# Altium schematic sheet ATWork2022.SchDoc
size 558 x 431 mm; SheetNumber: 1; SheetTotal: 1; SPICEModelCacheMCJPWGMP: <root> / <DocumentId>MCJPWGMP</DocumentId> / <CacheFrame Number="0"> / <Model Name="adc8" Kind="MDL"> / <Text>* 8-Bit generic A/D converter / * INPUTS  VCC, GND, VIN, VRP, VRM, SC, OE; / * OUTPUTS VCC_LD, SC_LD, OE_LD, OC, D0, D1, D2, D3, D4, D5, D6, D7; / .MODEL ADC8 xsimcode(file="{MODEL_PATH}ADC8.scb" func=ADC8 {mntymx})</Text> / </Model> / </CacheFrame> / </root>
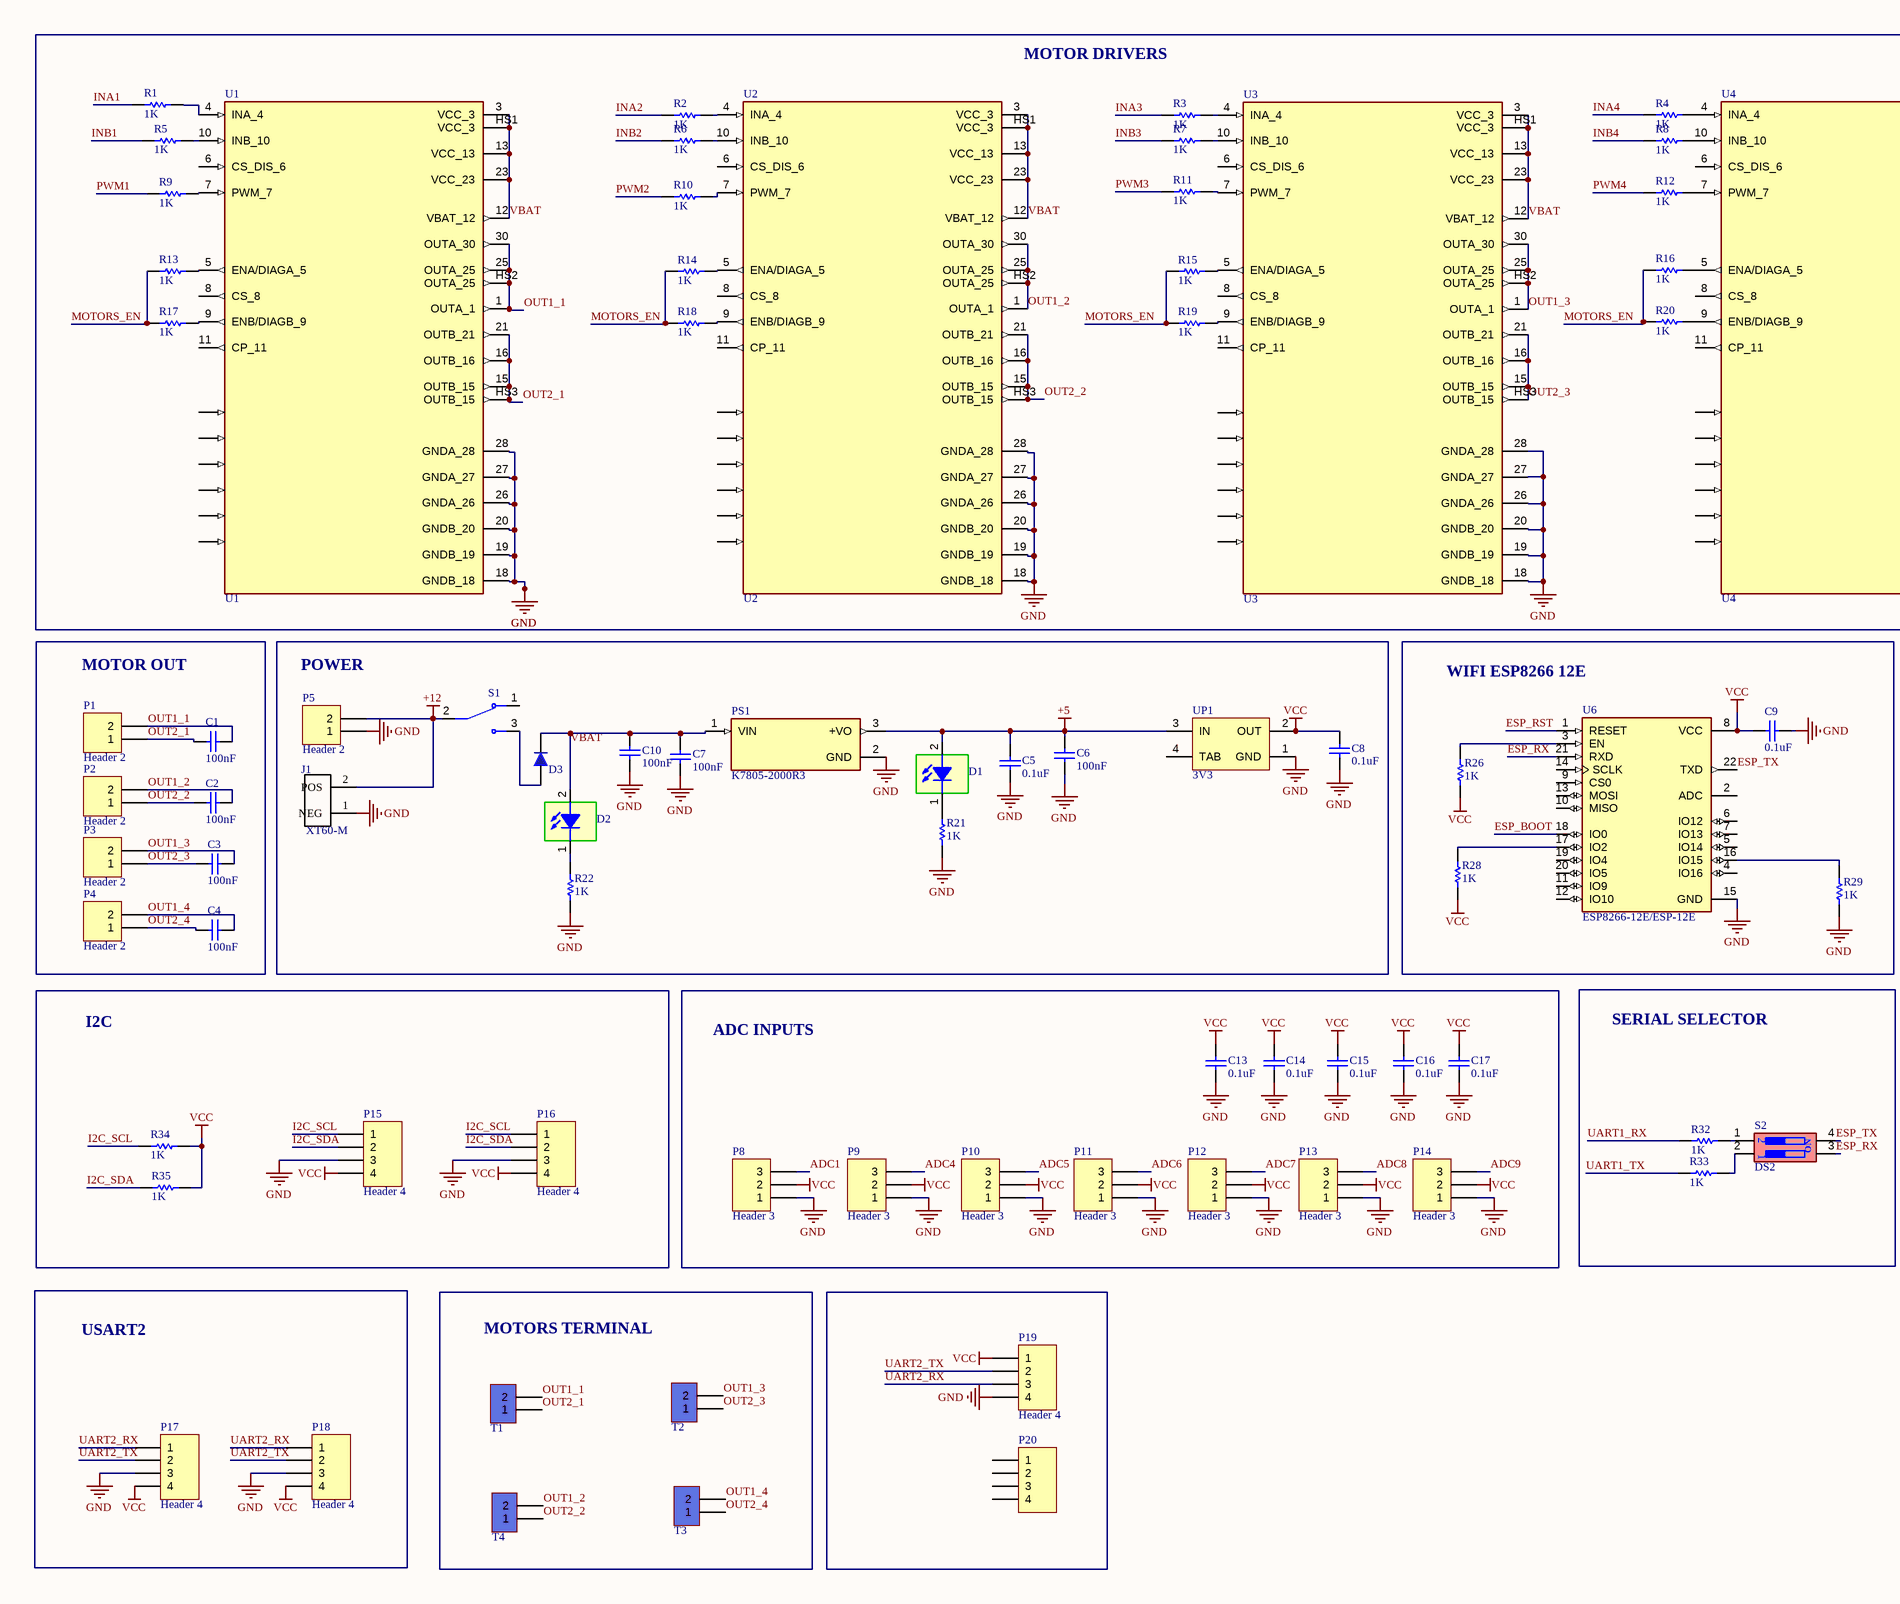
[diagram p0: ATWork2022.SchDoc, left]
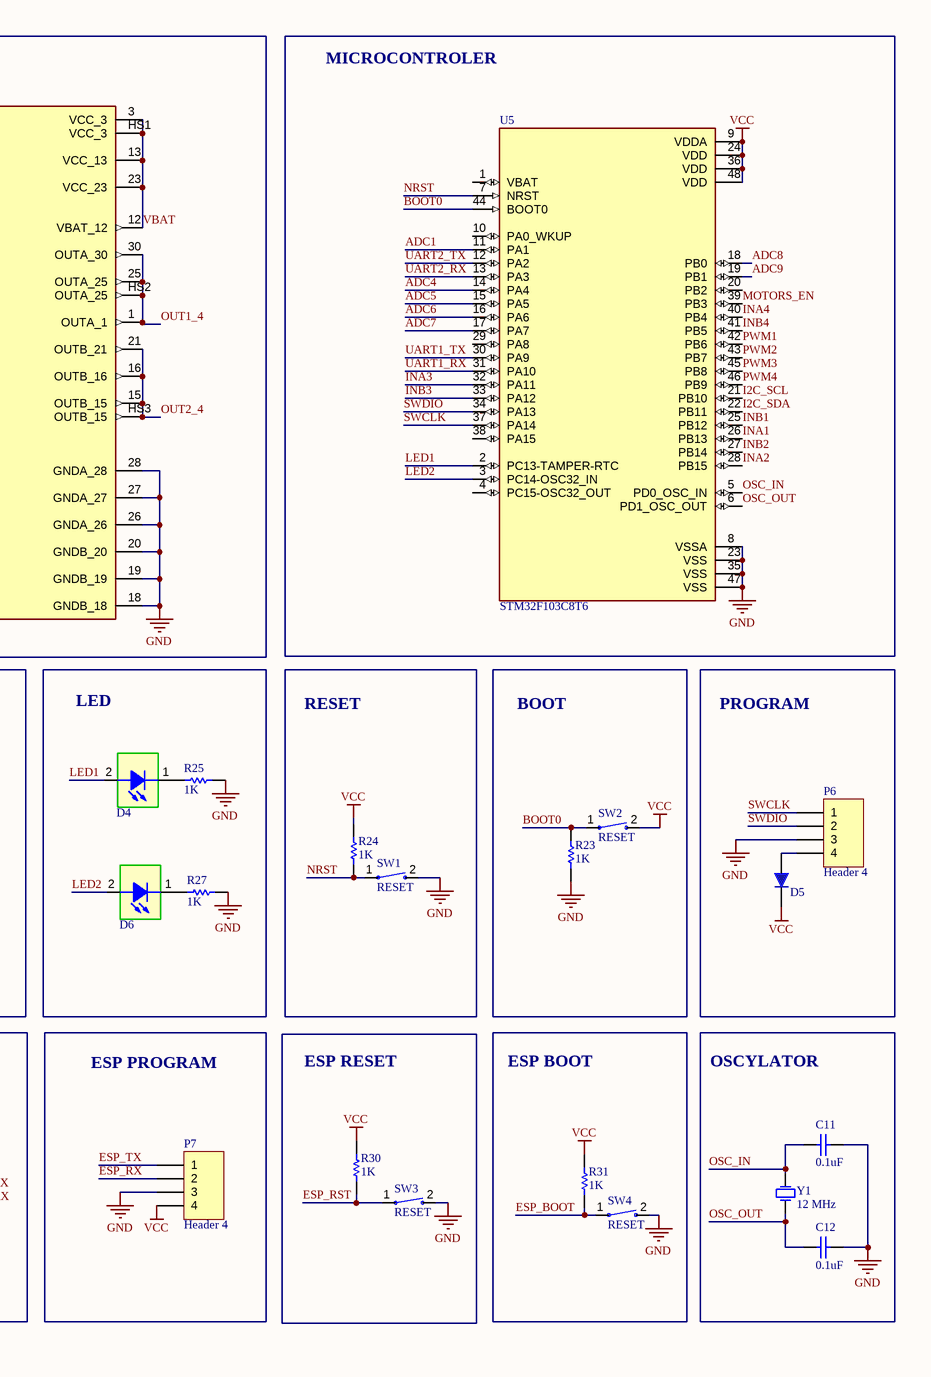
[diagram p1: ATWork2022.SchDoc, right]

## Parts
C1  100nF  [CAPC4817X12N]
C2  100nF  [CAPC4817X12N]
C3  100nF  [CAPC4817X12N]
C4  100nF  [CAPC4817X12N]
C5  0.1uF  [CAPC4817X12N]
C6  100nF  [Cap SMD 100UF 35~50v]
C7  100nF  [Cap SMD 100UF 35~50v]
C8  0.1uF  [CAPC4817X12N]
C9  0.1uF  [CAPC4817X12N]
C10  100nF  [Cap SMD 100UF 35~50v]
C11  0.1uF  [CAPC4817X12N]
C12  0.1uF  [CAPC4817X12N]
C13  0.1uF  [CAPC4817X12N]
C14  0.1uF  [CAPC4817X12N]
C15  0.1uF  [CAPC4817X12N]
C16  0.1uF  [CAPC4817X12N]
C17  0.1uF  [CAPC4817X12N]
D1  SMD 1206 LED  [LED 1206]  (value not drawn)
D2  SMD 1206 LED  [LED 1206]  (value not drawn)
D3  1n4007  [DIOM4629X24N]  (value not drawn)
D4  SMD 1206 LED  [LED 1206]  (value not drawn)
D5  1n4007  [DIOM4629X24N]  (value not drawn)
D6  SMD 1206 LED  [LED 1206]  (value not drawn)
J1  XT60-M  [*AMASS_XT60-M]
P1  Header 2  [HDR1X2]
P2  Header 2  [HDR1X2]
P3  Header 2  [HDR1X2]
P4  Header 2  [HDR1X2]
P5  Header 2  [HDR1X2]
P6  Header 4  [HDR1X4]
P7  Header 4  [HDR1X4]
P8  Header 3  [HDR1X3]
P9  Header 3  [HDR1X3]
P10  Header 3  [HDR1X3]
P11  Header 3  [HDR1X3]
P12  Header 3  [HDR1X3]
P13  Header 3  [HDR1X3]
P14  Header 3  [HDR1X3]
P15  Header 4  [HDR1X4]
P16  Header 4  [HDR1X4]
P17  Header 4  [HDR1X4]
P18  Header 4  [HDR1X4]
P19  Header 4  [HDR1X4]
P20  Header 4  [My_1X04]  (value not drawn)
PS1  K7805-2000R3  [CONV_K7805-2000R3]
R1  1K  [RESC3413X04N]
R2  1K  [RESC3413X04N]
R3  1K  [RESC3413X04N]
R4  1K  [RESC3413X04N]
R5  1K  [RESC3413X04N]
R6  1K  [RESC3413X04N]
R7  1K  [RESC3413X04N]
R8  1K  [RESC3413X04N]
R9  1K  [RESC3413X04N]
R10  1K  [RESC3413X04N]
R11  1K  [RESC3413X04N]
R12  1K  [RESC3413X04N]
R13  1K  [RESC3413X04N]
R14  1K  [RESC3413X04N]
R15  1K  [RESC3413X04N]
R16  1K  [RESC3413X04N]
R17  1K  [RESC3413X04N]
R18  1K  [RESC3413X04N]
R19  1K  [RESC3413X04N]
R20  1K  [RESC3413X04N]
R21  1K  [RESC3413X04N]
R22  1K  [RESC3413X04N]
R23  1K  [RESC3413X04N]
R24  1K  [RESC3413X04N]
R25  1K  [RESC3413X04N]
R26  1K  [RESC3413X04N]
R27  1K  [RESC3413X04N]
R28  1K  [RESC3413X04N]
R29  1K  [RESC3413X04N]
R30  1K  [RESC3413X04N]
R31  1K  [RESC3413X04N]
R32  1K  [RESC3413X04N]
R33  1K  [RESC3413X04N]
R34  1K  [RESC3413X04N]
R35  1K  [RESC3413X04N]
S1  (no value)  [SW_100SP1T1B4M2QE]
S2  DS2  [DIP Switch x2]
SW1  RESET  [SW_147873-1]
SW2  RESET  [SW_147873-1]
SW3  RESET  [SW_147873-1]
SW4  RESET  [SW_147873-1]
T1  KF301_Terminal  [KF301 2PIN]  (value not drawn)
T2  KF301_Terminal  [KF301 2PIN]  (value not drawn)
T3  KF301_Terminal  [KF301 2PIN]  (value not drawn)
T4  KF301_Terminal  [KF301 2PIN]  (value not drawn)
U1  U1  [IC_MULTIPOWERSO-30TR]
U2  U2  [IC_MULTIPOWERSO-30TR]
U3  U3  [IC_MULTIPOWERSO-30TR]
U4  U4  [IC_MULTIPOWERSO-30TR]
U5  STM32F103C8T6  [QFP50P900X900X160-48N]
U6  ESP8266-12E/ESP-12E  [XCVR_ESP8266-12E/ESP-12E]
UP1  3V3  [SOT223]
Y1  12 MHz  [Crystal SMD]

## Nets
+5: C5.2 C6.1 D1.2 PS1.3(+VO) UP1.3(IN)
+12: J1.2(POS) P5.2 S1.2
GND: C5.1 C6.2 C7.2 C8.1 C9.1 C10.2 C11.2 C12.2 C13.2 C14.2 C15.2 C16.2 C17.2 J1.1(NEG) P5.1 P6.3 P7.3 P8.1 P9.1 P10.1 P11.1 P12.1 P13.1 P14.1 P15.3 P16.3 P17.3 P18.3 P19.4 PS1.2(GND) R21.1 R22.1 R23.1 R25.1 R27.1 R29.1 SW1.2 SW3.2 SW4.2 U1.18(GNDB_18) U1.19(GNDB_19) U1.20(GNDB_20) U1.26(GNDA_26) U1.27(GNDA_27) U1.28(GNDA_28) U2.18(GNDB_18) U2.19(GNDB_19) U2.20(GNDB_20) U2.26(GNDA_26) U2.27(GNDA_27) U2.28(GNDA_28) U3.18(GNDB_18) U3.19(GNDB_19) U3.20(GNDB_20) U3.26(GNDA_26) U3.27(GNDA_27) U3.28(GNDA_28) U4.18(GNDB_18) U4.19(GNDB_19) U4.20(GNDB_20) U4.26(GNDA_26) U4.27(GNDA_27) U4.28(GNDA_28) U5.8(VSSA) U5.23(VSS) U5.35(VSS) U5.47(VSS) U6.15(GND) UP1.1(GND)
VCC: C8.2 C9.2 C13.1 C14.1 C15.1 C16.1 C17.1 D5.2 P7.4 P8.2 P9.2 P10.2 P11.2 P12.2 P13.2 P14.2 P15.4 P16.4 P17.4 P18.4 P19.1 R24.1 R26.2 R28.2 R30.2 R31.2 R34.2 R35.2 SW2.2 U5.9(VDDA) U5.24(VDD) U5.36(VDD) U5.48(VDD) U6.8(VCC) UP1.2(OUT)
ADC1: P8.3 U5.11(PA1)
ADC4: P9.3 U5.14(PA4)
ADC5: P10.3 U5.15(PA5)
ADC6: P11.3 U5.16(PA6)
ADC7: P12.3 U5.17(PA7)
ADC8: P13.3 U5.18(PB0)
ADC9: P14.3 U5.19(PB1)
BOOT0: R23.2 SW2.1 U5.44(BOOT0)
ESP_BOOT: R31.1 SW4.1 U6.18(IO0)
ESP_RST: R30.1 SW3.1 U6.1(RESET)
ESP_RX: P7.2 S2.3 U6.21(RXD)
ESP_TX: P7.1 S2.4 U6.22(TXD)
I2C_SCL: P15.1 P16.1 R34.1 U5.21(PB10)
I2C_SDA: P15.2 P16.2 R35.1 U5.22(PB11)
INA1: R1.1 U5.26(PB13)
INA2: R2.1 U5.28(PB15)
INA3: R3.1 U5.32(PA11)
INA4: R4.1 U5.40(PB4)
INB1: R5.1 U5.25(PB12)
INB2: R6.1 U5.27(PB14)
INB3: R7.1 U5.33(PA12)
INB4: R8.1 U5.41(PB5)
LED1: D4.2 U5.2(PC13-TAMPER-RTC)
LED2: D6.2 U5.3(PC14-OSC32_IN)
MOTORS_EN: R13.1 R14.1 R15.1 R16.1 R17.1 R18.1 R19.1 R20.1 U5.39(PB3)
NRST: R24.2 SW1.1 U5.7(NRST)
OSC_IN: C11.1 U5.5(PD0_OSC_IN) Y1.2(OSC2)
OSC_OUT: C12.1 U5.6(PD1_OSC_OUT) Y1.1(OSC1)
OUT1_1: C1.1 P1.2 T1.2 U1.1(OUTA_1) U1.25(OUTA_25) U1.30(OUTA_30) U1.HS2(OUTA_25)
OUT1_2: C2.1 P2.2 T4.2 U2.1(OUTA_1) U2.25(OUTA_25) U2.30(OUTA_30) U2.HS2(OUTA_25)
OUT1_3: C3.1 P3.2 T2.2 U3.1(OUTA_1) U3.25(OUTA_25) U3.30(OUTA_30) U3.HS2(OUTA_25)
OUT1_4: C4.1 P4.2 T3.2 U4.1(OUTA_1) U4.25(OUTA_25) U4.30(OUTA_30) U4.HS2(OUTA_25)
OUT2_1: C1.2 P1.1 T1.1 U1.15(OUTB_15) U1.16(OUTB_16) U1.21(OUTB_21) U1.HS3(OUTB_15)
OUT2_2: C2.2 P2.1 T4.1 U2.15(OUTB_15) U2.16(OUTB_16) U2.21(OUTB_21) U2.HS3(OUTB_15)
OUT2_3: C3.2 P3.1 T2.1 U3.15(OUTB_15) U3.16(OUTB_16) U3.21(OUTB_21) U3.HS3(OUTB_15)
OUT2_4: C4.2 P4.1 T3.1 U4.15(OUTB_15) U4.16(OUTB_16) U4.21(OUTB_21) U4.HS3(OUTB_15)
PWM1: R9.1 U5.42(PB6)
PWM2: R10.1 U5.43(PB7)
PWM3: R11.1 U5.45(PB8)
PWM4: R12.1 U5.46(PB9)
SWCLK: P6.1 U5.37(PA14)
SWDIO: P6.2 U5.34(PA13)
UART1_RX: R32.1 U5.31(PA10)
UART1_TX: R33.2 U5.30(PA9)
UART2_RX: P17.1 P18.1 P19.3 U5.13(PA3)
UART2_TX: P17.2 P18.2 P19.2 U5.12(PA2)
VBAT: C7.1 C10.1 D2.2 D3.2 PS1.1(VIN) U1.3(VCC_3) U1.12(VBAT_12) U1.13(VCC_13) U1.23(VCC_23) U1.HS1(VCC_3) U2.3(VCC_3) U2.12(VBAT_12) U2.13(VCC_13) U2.23(VCC_23) U2.HS1(VCC_3) U3.3(VCC_3) U3.12(VBAT_12) U3.13(VCC_13) U3.23(VCC_23) U3.HS1(VCC_3) U4.3(VCC_3) U4.12(VBAT_12) U4.13(VCC_13) U4.23(VCC_23) U4.HS1(VCC_3)
NetD1_1: D1.1 R21.2
NetD2_1: D2.1 R22.2
NetD3_1: D3.1 S1.3
NetD4_1: D4.1 R25.2
NetD5_1: D5.1 P6.4
NetD6_1: D6.1 R27.2
NetR1_2: R1.2 U1.4(INA_4)
NetR2_2: R2.2 U2.4(INA_4)
NetR3_2: R3.2 U3.4(INA_4)
NetR4_2: R4.2 U4.4(INA_4)
NetR5_2: R5.2 U1.10(INB_10)
NetR6_2: R6.2 U2.10(INB_10)
NetR7_2: R7.2 U3.10(INB_10)
NetR8_2: R8.2 U4.10(INB_10)
NetR9_2: R9.2 U1.7(PWM_7)
NetR10_2: R10.2 U2.7(PWM_7)
NetR11_2: R11.2 U3.7(PWM_7)
NetR12_2: R12.2 U4.7(PWM_7)
NetR13_2: R13.2 U1.5(ENA/DIAGA_5)
NetR14_2: R14.2 U2.5(ENA/DIAGA_5)
NetR15_2: R15.2 U3.5(ENA/DIAGA_5)
NetR16_2: R16.2 U4.5(ENA/DIAGA_5)
NetR17_2: R17.2 U1.9(ENB/DIAGB_9)
NetR18_2: R18.2 U2.9(ENB/DIAGB_9)
NetR19_2: R19.2 U3.9(ENB/DIAGB_9)
NetR20_2: R20.2 U4.9(ENB/DIAGB_9)
NetR26_1: R26.1 U6.3(EN)
NetR28_1: R28.1 U6.17(IO2)
NetR29_2: R29.2 U6.16(IO15)
NetR32_2: R32.2 S2.1
NetR33_1: R33.1 S2.2

Not connected (* = marked no-connect by the designer): P20 1 2 3 4; S1 1; U1 2(N.C._2) 6(CS_DIS_6) 8(CS_8) 11(CP_11) 14(NC_14) 17(NC_17) 22(NC_22) 24(NC_24) 29(N.C._29); U2 2(N.C._2) 6(CS_DIS_6) 8(CS_8) 11(CP_11) 14(NC_14) 17(NC_17) 22(NC_22) 24(NC_24) 29(N.C._29); U3 2(N.C._2) 6(CS_DIS_6) 8(CS_8) 11(CP_11) 14(NC_14) 17(NC_17) 22(NC_22) 24(NC_24) 29(N.C._29); U4 2(N.C._2) 6(CS_DIS_6) 8(CS_8) 11(CP_11) 14(NC_14) 17(NC_17) 22(NC_22) 24(NC_24) 29(N.C._29); U5 1(VBAT) 4(PC15-OSC32_OUT) 10(PA0_WKUP) 20(PB2) 29(PA8) 38(PA15); U6 2(ADC) 4(IO16) 5(IO14) 6(IO12) 7(IO13) 9(CS0) 10(MISO) 11(IO9) 12(IO10) 13(MOSI) 14(SCLK) 19(IO4) 20(IO5); UP1 4(TAB)

## Notes on the sheet
- MOTOR DRIVERS
- MICROCONTROLER
- (near P1) MOTOR OUT
- (near P5) POWER
- WIFI ESP8266 12E
- LED
- RESET
- BOOT
- PROGRAM
- I2C
- ADC INPUTS
- SERIAL SELECTOR
- ESP PROGRAM
- ESP RESET
- ESP BOOT
- OSCYLATOR
- USART2
- MOTORS TERMINAL
- DWG. NO.
- REV.
- SHT.
- REVISION
- DESCRIPTION
- DATE
- APPROVED
- THIS DOCUMENT AND THE DATA DISCLOSED HEREIN OR HEREWITH IS THE PROPERTY OF ALTIUM LIMITED AND MAY BE FREELY DISTRIBUTED IN WHOLE. NO RIGHTS ARE RESERVED OR EXPRESS OR IMPLIED WARANTEE GIVEN.
- ENG:
- DSN:
- APPROVALS
- PROJECT
- DOCUMENT REVISION:
- DESIGN ITEM:
- CHK:
- BOM:
- REFERENCE DOCUMENTS
- PROJECT REVISION:
- TITLE
- FAB DWG:
- PCB DWG:
- ASSY DWG:
- SCALE:
- SIZE
- C
- CAGE CODE
- FILE NAME
- DWG NO.
- SHEET
- OF
- REV
- (in symbol DIP Switch 2) ON

## Library data of the parts
C1-C5 C8 C9 C11-C17 = CAP SMD 1206: CAP 1206; Designer: Abbas Basereh; Desc.: CAP SMD 1206; Data: 16-12-2016
C6 C7 C10 = CAP SMD PACKAGE: TOTAL CAPACITOR SMD PACK; Designer: Abbas Basereh; Desc.: CAP SMD TOTAL PACKAGES; Data: 2017-3-10; VALUE: 100nF
D1 D2 D4 D6 = LED SMD 1206
D3 D5 = 1n4007 SMD M7: Standard Rectifiers; Part. No: M7; Manufacturer: DC COMPONENTS; Designer: Abbas Basereh; Link: http://www.tme.eu/en/details/m7/smd-universal-diodes/dc-components/; Link: https://www.aliexpress.com/item/Smd-tube-1n4007-m7-SMA/1213719741.html?spm=2114.01010208.3.1.ZyZ7bC&ws_ab_test=searchweb0_0,searchweb201602_4_10065_10068_10084_10083_10080_10082_10081_10060_10061_10062_10056_10055_10054_10059_10099_10078_10079_427_10073_10103_10102_10096_10052_10050_10051,searchweb201603_4&btsid=db2be5ca-e560-400a-b91c-484ab5ee228b; Data: 16-12-2016
J1 = XT60-M: Plug; DC supply; XT60; male; PIN: 2; for cable; soldered; 30A; 500V; MF: AMASS; Availability: Unavailable; Package: Package Analog Devices; Price: None; SnapEDA_Link: https://www.snapeda.com/parts/XT60-M/AMASS/view-part/2883912/?ref=snap; MP: XT60-M; Value: *
P1-P5 = Header 2: Header, 2-Pin; LatestRevisionDate: 17-Jul-2002; LatestRevisionNote: Re-released for DXP Platform.; Publisher: Altium Limited
P6 P7 P15-P20 = Header 4: Header, 4-Pin; LatestRevisionDate: 17-Jul-2002; LatestRevisionNote: Re-released for DXP Platform.; Publisher: Altium Limited
P8-P14 = Header 3: Header, 3-Pin; LatestRevisionDate: 17-Jul-2002; LatestRevisionNote: Re-released for DXP Platform.; Publisher: Altium Limited
PS1 = K7805-2000R3: éžçµ¶ç¸åž‹ PoL ãƒ¢ã‚¸ãƒ¥ãƒ¼ãƒ« DC DC ã‚³ãƒ³ãƒãƒ¼ã‚¿ 1 å‡ºåŠ› 5V 2A 8V - 36V å…¥åŠ›; MF: Mornsun America, LLC; SnapEDA_Link: https://www.snapeda.com/parts/K7805-2000R3/MORNSUN/view-part/5366399/?ref=snap; Value: *; MP: K7805-2000R3; Package: SIP-3-3 MORNSUN; Digi-Key_Part_Number: 2725-K7805-2000R3-ND; Check_prices: https://www.snapeda.com/parts/K7805-2000R3/MORNSUN/view-part/5366399/?ref=eda
R1-R35 = RES 0805 0.125W: RES 0805; Designer: Abbas Basereh; Desc.: RES SMD 0805; Data: 16-12-2016
S1 = 100SP1T1B4M2QE: Toggle Switch SPDT Through Hole; Value: *; Availability: Unavailable; Price: None; MP: 100SP1T1B4M2QE; Package: None
S2 = DIP Switch 2: 2 BIT DIP Switch
SW1-SW4 = 147873-1: Switch Tactile OFF (ON) SPST Rectangular Button J-Bend 0.05A 24VDC 1.77N SMD T/R; MF: TE Connectivity; SnapEDA_Link: https://www.snapeda.com/parts/147873-1/TE%20Connectivity%20ALCOSWITCH%20Switches/view-part/2549694/?ref=snap; Availability: Unavailable; Value: *; Price: None; MP: 147873-1; Package: None
T1-T4 = KF301-2Pin_Terminal: Terminal 2 Pin 250VAC 16A; Part. No: KF301 2P; Designer: Abbas Basereh; Link: https://www.aliexpress.com/item/
U1-U4 = VNH5019A-E: Motor Driver Power MOSFET Parallel, PWM MultiPowerSO-30; MF: STMicroelectronics; Value: *; Availability: Unavailable; MP: VNH5019A-E; Price: None; Package: PowerSOP-30 STMicroelectronics; SnapEDA_Link: https://www.snapeda.com/parts/VNH5019A-E/STMicroelectronics/view-part/231156/?ref=snap
U5 = STM32F103C8T6: Mainstream Performance line, ARM Cortex-M3 MCU with 64 Kbytes Flash, 72 MHz CPU, motor control, USB and CAN; Value: *; Availability: Unavailable; Price: None; Package: None; MP: STM32F103C8T6
U6 = ESP8266-12E/ESP-12E: ESP-12E WiFi Module; Value: *; MP: ESP8266-12E/ESP-12E; Availability: Unavailable; Package: None; Price: None
UP1 = AMS1117-x.x: x.x Volt, 800mA Low-Dropout Linear Regulator, 4-pin SOT-223; Designer: Ali Hafizi; Data: 16-12-2016
Y1 = XTAL: XTAL Crystal; Designer: ABBAS BASEREH; Design Date: 2017-1-3; ComponentLink1Description: Datasheet; ComponentLink2Description: Reference; Mounting Technology: Surface Mount\Through-Hole; Value: 12 MHz; Status: Unreleased